# Altium project MEGA_Project.PrjPcb
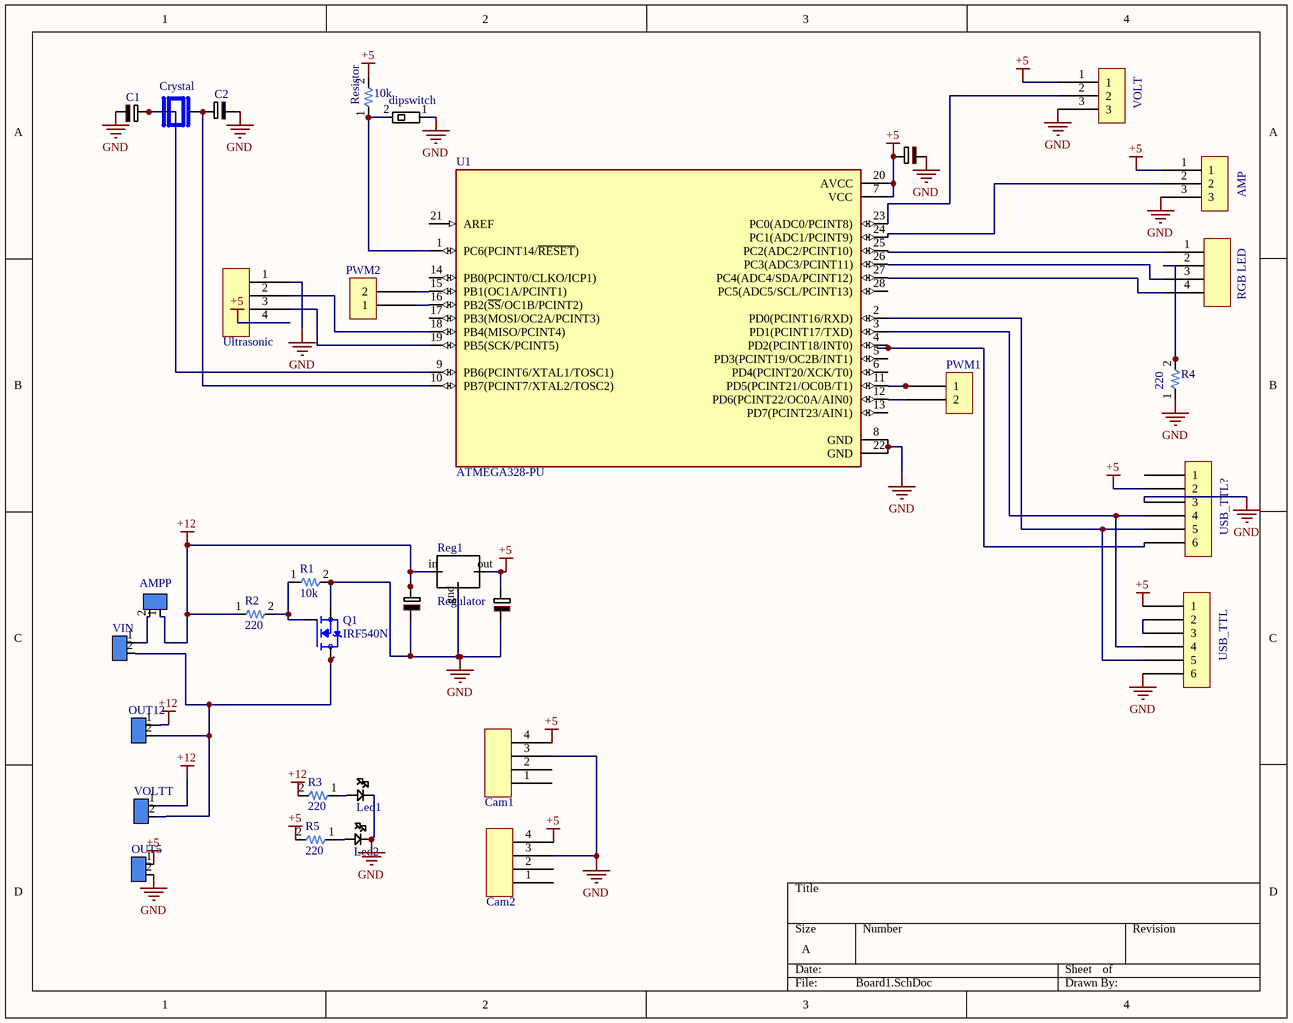
[diagram p0: Board1.SchDoc]
1 sheet, 33 parts. Net scope: global (net labels, ports and power ports of the same name join across sheets).
Board file: Board1.PcbDoc

## Sheet Board1.SchDoc
size A; SheetNumber: 1; SheetTotal: 1

### Parts
10k  Resistor  [Resistor]
*  dipswitch  [dipswitch]
AMP  Header 1x3  [pinheaders 3 pins]  (value not drawn)
AMPP  Terminal Block  [Terminal Block]  (value not drawn)
Bluetooth  Header 1x6  [pinheaders 6 pins]  (value not drawn)
C1  ceramic  [ceramic cap]  (value not drawn)
C2  ceramic  [ceramic cap]  (value not drawn)
Cam1  Header 1x4  [pinheaders 4 pins]  (value not drawn)
Cam2  2  [pinheaders 4 pins]  (value not drawn)
Cap1  Capacitor  [Capacitor]  (value not drawn)
Cap2  Capacitor  [Capacitor]  (value not drawn)
Cap3  Capacitor  [Capacitor]  (value not drawn)
Crystal  Crystal  [crystal]  (value not drawn)
Led1  Led 5mm  [LED]  (value not drawn)
Led2  Led 5mm  [LED]  (value not drawn)
OUT5  Terminal Block  [Terminal Block]  (value not drawn)
OUT12  Terminal Block  [Terminal Block]  (value not drawn)
PWM1  Header 2x1  [pinheaders 2 pins]  (value not drawn)
PWM2  Header 2x1  [pinheaders 2 pins]  (value not drawn)
Q1  IRF540N  [irf540n]
R1  10k  [Resistor]
R2  220  [Resistor]
R3  220  [Resistor]
R4  220  [Resistor]
R5  220  [Resistor]
Reg1  Regulator  [Regulator]
RGB_LED  Header 1x4  [pinheaders 4 pins]  (value not drawn)
U1  ATMEGA328-PU  [ATMEGA328PU]
Ultrasonic  Header 1x4  [pinheaders 4 pins]  (value not drawn)
USB_TTL  Header 1x6  [pinheaders 6 pins]  (value not drawn)
VIN  Terminal Block  [Terminal Block]  (value not drawn)
VOLT  Header 1x3  [pinheaders 3 pins]  (value not drawn)
VOLTT  Terminal Block  [Terminal Block]  (value not drawn)

### Nets
+5: 10k.2 AMP.1 Bluetooth.2 Cam1.4 Cam2.4 Cap1.anode Cap3.anode OUT5.1 R5.2 Reg1.out U1.7(VCC) U1.20(AVCC) Ultrasonic.4 USB_TTL.1 VOLT.1
+12: AMPP.1 Cap2.anode OUT12.1 R2.1 R3.2 Reg1.in VOLTT.1
GND: *.1 AMP.3 Bluetooth.3 C1.1 C2.1 Cam1.3 Cam2.3 Cap1.cathode Cap2.cathode Cap3.cathode Led1.cathode Led2.cathode OUT5.2 Q1.3(S) R1.2 R4.1 Reg1.gnd U1.8(GND) U1.22(GND) Ultrasonic.1 USB_TTL.6 VOLT.3
Net10k_1: 10k.1 *.2 U1.1(PC6(PCINT14/~{RESET}))
NetAMP_2: AMP.2 U1.24(PC1(ADC1/PCINT9))
NetAMPP_2: AMPP.2 VIN.1
NetBluetooth_4: Bluetooth.4 U1.3(PD1(PCINT17/TXD)) USB_TTL.4
NetBluetooth_5: Bluetooth.5 U1.2(PD0(PCINT16/RXD)) USB_TTL.5
NetBluetooth_6: Bluetooth.6 U1.4(PD2(PCINT18/INT0))
NetC1_2: C1.2 Crystal.1 U1.9(PB6(PCINT6/XTAL1/TOSC1))
NetC2_2: C2.2 Crystal.2 U1.10(PB7(PCINT7/XTAL2/TOSC2))
NetLed1_anode: Led1.anode R3.1
NetLed2_anode: Led2.anode R5.1
NetOUT12_2: OUT12.2 Q1.2(D) VIN.2 VOLTT.2
NetPWM1_1: PWM1.1 U1.11(PD5(PCINT21/OC0B/T1))
NetPWM1_2: PWM1.2 U1.12(PD6(PCINT22/OC0A/AIN0))
NetPWM2_1: PWM2.1 U1.16(PB2(~{SS}/OC1B/PCINT2))
NetPWM2_2: PWM2.2 U1.15(PB1(OC1A/PCINT1))
NetQ1_1: Q1.1(G) R1.1 R2.2
NetR4_2: R4.2 RGB_LED.2
NetRGB_LED_1: RGB_LED.1 U1.25(PC2(ADC2/PCINT10))
NetRGB_LED_3: RGB_LED.3 U1.26(PC3(ADC3/PCINT11))
NetRGB_LED_4: RGB_LED.4 U1.27(PC4(ADC4/SDA/PCINT12))
NetU1_18: U1.18(PB4(MISO/PCINT4)) Ultrasonic.2
NetU1_19: U1.19(PB5(SCK/PCINT5)) Ultrasonic.3
NetU1_23: U1.23(PC0(ADC0/PCINT8)) VOLT.2
NetUSB_TTL_2: USB_TTL.2 USB_TTL.3

Not connected (* = marked no-connect by the designer): Bluetooth 1; Cam1 1 2; Cam2 1 2; U1 5(PD3(PCINT19/OC2B/INT1)) 6(PD4(PCINT20/XCK/T0)) 13(PD7(PCINT23/AIN1)) 14(PB0(PCINT0/CLKO/ICP1)) 17(PB3(MOSI/OC2A/PCINT3)) 21(AREF) 28(PC5(ADC5/SCL/PCINT13))

### Library data of the parts
C1 C2 = ceramic cap
Cam2 = Header 1x4
Crystal = Crystal: 8MHz Â±30ppm Crystal 20pF 60 Ohms HC-49/US; MF: CTS-Frequency Controls; MP: ATS08A-E; Price: None; Availability: Good; Package: HC-49/US CTS-Frequency Controls; Purchase-URL: https://pricing.snapeda.com/search/part/ATS08A-E/?ref=eda; SnapEDA_Link: https://www.snapeda.com/parts/ATS08A-E/CTS-Frequency%20Controls/view-part/2457201/?ref=snap; Value: *; Check_prices: https://www.snapeda.com/parts/ATS08A-E/CTS-Frequency%20Controls/view-part/2457201/?ref=eda
Q1 = IRF540NPBF: RoHS Compliant | Low RDS(on) | Industry-leading quality | Dynamic dv/dt Rating | Fast Switching | Fully Avalanche Rated | 175C Operating Temperature; MF: Infineon; Value: *; SnapEDA_Link: https://www.snapeda.com/parts/IRF540NPBF/Infineon+Technologies/view-part/?ref=snap; MP: IRF540NPBF; Purchase-URL: https://pricing.snapeda.com/search/part/IRF540NPBF/?ref=eda; Check_prices: https://www.snapeda.com/parts/IRF540NPBF/Infineon+Technologies/view-part/?ref=eda; Availability: In Stock; Price: None; Package: TO-220 Infineon
R1-R5 = Resistor
U1 = ATMEGA328-PU: AVR AVRÂ® ATmega Microcontroller IC 8-Bit 20MHz 32KB (16K x 16) FLASH 28-PDIP; MF: Microchip; Availability: In Stock; MP: ATMEGA328-PU; SnapEDA_Link: https://www.snapeda.com/parts/ATMEGA328-PU/Microchip/view-part/?ref=snap; Value: *; Price: None; Purchase-URL: https://pricing.snapeda.com/search/part/ATMEGA328-PU/?ref=eda; Check_prices: https://www.snapeda.com/parts/ATMEGA328-PU/Microchip/view-part/?ref=eda; Package: DIP-28 Microchip Technology